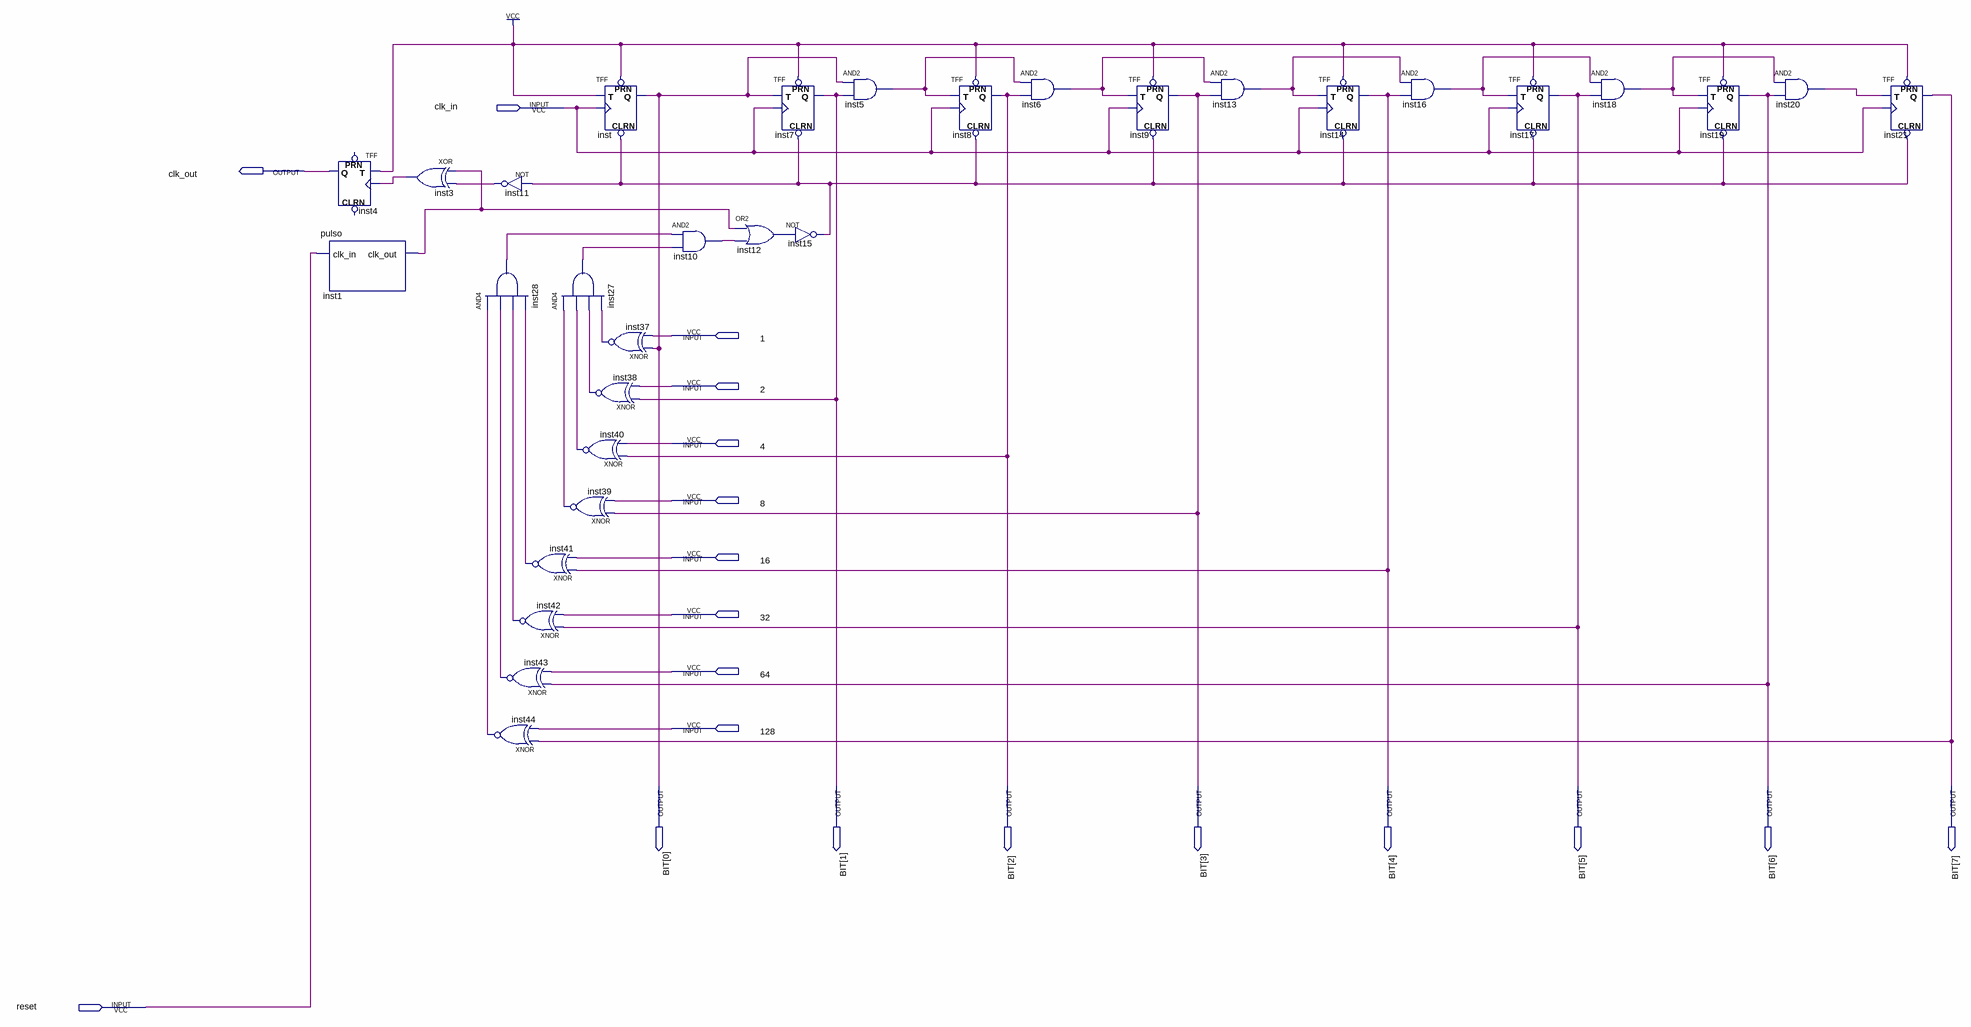
[diagram p0: schematic sheet]
// Quartus schematic contador_sync_8bits.bdf as structural Verilog: 31 symbols, 19 pins
module contador_sync_8bits (
  input  clk_in,
  input  \1 ,
  input  \2 ,
  input  \4 ,
  input  \8 ,
  input  \16 ,
  input  \32 ,
  input  \64 ,
  input  \128 ,
  input  reset,
  output clk_out,
  output [7:0] BIT
);

  wire inst1_clk_out, inst3_out, inst5_out, inst6_out, inst10_out, inst11_out, inst12_out, inst13_out,
       inst15_out, inst16_out, inst18_out, inst20_out, inst27_out, inst28_out, inst37_out, inst38_out,
       inst39_out, inst40_out, inst41_out, inst42_out, inst43_out, inst44_out;

  TFF inst4 (.T(1'b1), .CLK(inst3_out), .Q(clk_out));  // open: PRN, CLRN
  pulso inst1 (.clk_in(reset), .clk_out(inst1_clk_out));
  xor inst3 (inst3_out, inst1_clk_out, inst11_out);
  and inst28 (inst28_out, inst44_out, inst43_out, inst42_out, inst41_out);
  not inst11 (inst11_out, inst15_out);
  xnor inst41 (inst41_out, BIT[4], \16 );
  xnor inst42 (inst42_out, BIT[5], \32 );
  xnor inst43 (inst43_out, BIT[6], \64 );
  xnor inst44 (inst44_out, BIT[7], \128 );
  and inst27 (inst27_out, inst39_out, inst40_out, inst38_out, inst37_out);
  xnor inst40 (inst40_out, BIT[2], \4 );
  xnor inst39 (inst39_out, BIT[3], \8 );
  TFF inst (.PRN(1'b1), .CLRN(inst15_out), .T(1'b1), .CLK(clk_in), .Q(BIT[0]));
  xnor inst37 (inst37_out, BIT[0], \1 );
  xnor inst38 (inst38_out, BIT[1], \2 );
  and inst10 (inst10_out, inst28_out, inst27_out);
  or inst12 (inst12_out, inst1_clk_out, inst10_out);
  TFF inst7 (.PRN(1'b1), .CLRN(inst15_out), .T(BIT[0]), .CLK(clk_in), .Q(BIT[1]));
  not inst15 (inst15_out, inst12_out);
  and inst5 (inst5_out, BIT[0], BIT[1]);
  TFF inst8 (.PRN(1'b1), .CLRN(inst15_out), .T(inst5_out), .CLK(clk_in), .Q(BIT[2]));
  and inst6 (inst6_out, inst5_out, BIT[2]);
  TFF inst9 (.PRN(1'b1), .CLRN(inst15_out), .T(inst6_out), .CLK(clk_in), .Q(BIT[3]));
  and inst13 (inst13_out, inst6_out, BIT[3]);
  TFF inst14 (.PRN(1'b1), .CLRN(inst15_out), .T(inst13_out), .CLK(clk_in), .Q(BIT[4]));
  and inst16 (inst16_out, inst13_out, BIT[4]);
  TFF inst17 (.PRN(1'b1), .CLRN(inst15_out), .T(inst16_out), .CLK(clk_in), .Q(BIT[5]));
  and inst18 (inst18_out, inst16_out, BIT[5]);
  TFF inst19 (.PRN(1'b1), .CLRN(inst15_out), .T(inst18_out), .CLK(clk_in), .Q(BIT[6]));
  and inst20 (inst20_out, inst18_out, BIT[6]);
  TFF inst21 (.PRN(1'b1), .CLRN(inst15_out), .T(inst20_out), .CLK(clk_in), .Q(BIT[7]));
endmodule
